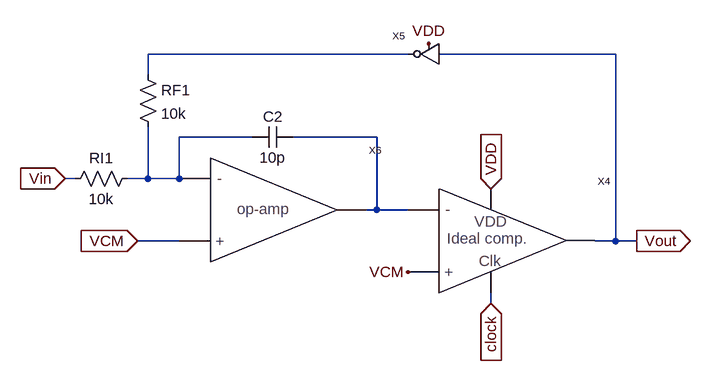
[diagram p0: schematic 1_bit_1st_ANS_mod_MSD.asc]
1_bit_1st_ANS_mod_MSD.asc, the LTspice schematic file:
Version 4
SHEET 1 880 680
WIRE -400 -752 -800 -752
WIRE -80 -752 -352 -752
WIRE -800 -720 -800 -752
WIRE -640 -624 -752 -624
WIRE -448 -624 -576 -624
WIRE -912 -560 -928 -560
WIRE -800 -560 -800 -640
WIRE -800 -560 -832 -560
WIRE -752 -560 -752 -624
WIRE -752 -560 -800 -560
WIRE -448 -512 -448 -624
WIRE -448 -512 -464 -512
WIRE -400 -512 -448 -512
WIRE -752 -464 -816 -464
WIRE -80 -464 -80 -752
WIRE -80 -464 -112 -464
WIRE -48 -464 -80 -464
WIRE -272 -368 -272 -384
FLAG -272 -544 VDD
IOPIN -272 -544 In
FLAG -272 -368 clock
IOPIN -272 -368 In
FLAG -48 -464 Vout
IOPIN -48 -464 Out
FLAG -928 -560 Vin
IOPIN -928 -560 In
FLAG -816 -464 VCM
IOPIN -816 -464 In
FLAG -400 -416 VCM
FLAG -368 -768 VDD
SYMBOL Ideal_clocked_comparator -352 -464 R0
SYMATTR InstName X4
SYMBOL cap -640 -608 R270
WINDOW 0 32 32 VTop 0
WINDOW 3 0 32 VBottom 0
SYMATTR InstName C2
SYMATTR Value 10p
SYMBOL res -816 -576 R90
WINDOW 0 0 56 VBottom 0
WINDOW 3 32 56 VTop 0
SYMATTR InstName RI1
SYMATTR Value 10k
SYMBOL res -816 -736 R0
SYMATTR InstName RF1
SYMATTR Value 10k
SYMBOL inverter -352 -752 M0
SYMATTR InstName X5
SYMBOL op_amp -704 -512 R0
SYMATTR InstName X6

The netlist it stands for:
* 1_bit_1st_ANS_mod_MSD.asc
XX4 N003 VCM Vout VDD clock Ideal_clocked_comparator  ; pins Vinm Vinp Vout VDD Clock
C2 N002 N003 10p
RI1 N002 Vin 10k
RF1 N001 N002 10k
XX5 Vout N001 VDD inverter  ; pins In Out VDD
XX6 N002 VCM N003 op_amp  ; pins Vinm Vinp Out
.backanno
.end